# Altium project USTRZ.PrjPcb
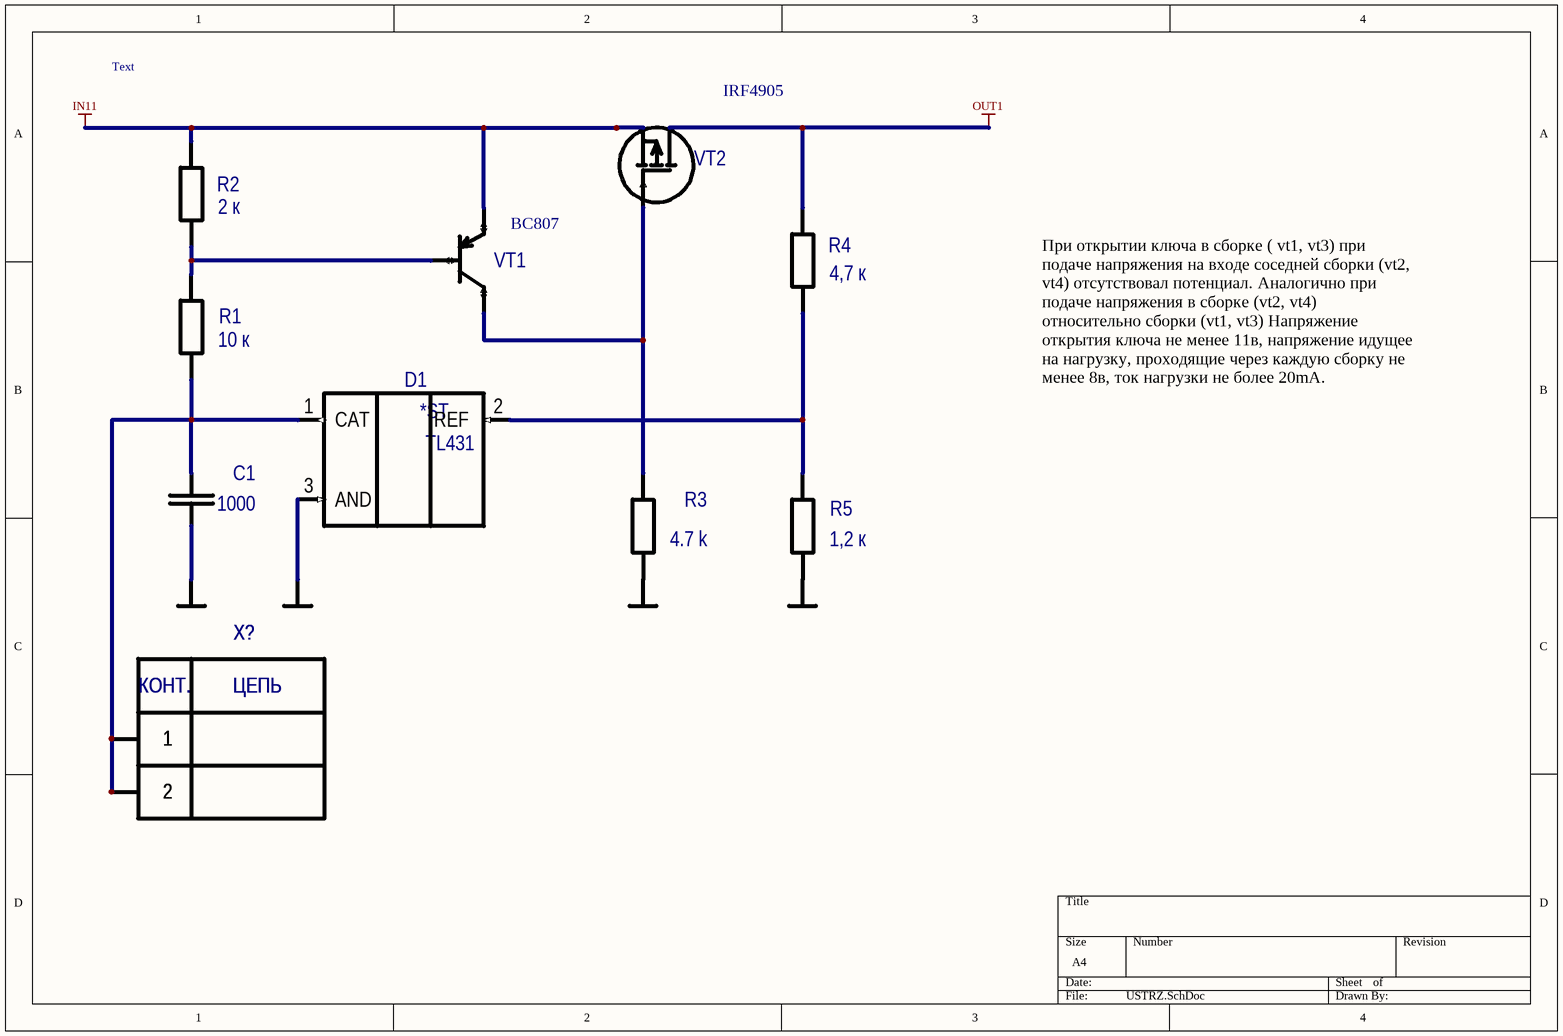
[diagram p0: USTRZ.SchDoc]
1 sheet, 13 parts. Net scope: global (net labels, ports and power ports of the same name join across sheets).
Board file: PCB1.PcbDoc

## Sheet USTRZ.SchDoc
size A4; SheetNumber: 1; SheetTotal: 1

### Parts
(Parts that share a designator on the sheet are numbered #1, #2 ... from top to bottom, then left to right.)
C1  1000  [CAPC1608L]
D1  TL431BIDBZR  [SOT23-3L]  (value not drawn)
R1  10 к  [RESC1608L]
R2  2 к  [RESC1608L]
R3  4.7 k  [RESC2012L]
R4  4,7 к  [RESC1608L]
R5  1,2 к  [RESC1608L]
VT1  (no value)  [SOT23-3L]
VT2  AUIRF5210S  [TO-263AB]  (value not drawn)
X?#1  2edg2  [2edg2]  (value not drawn)
X?#2  2edg2  [2edg2]  (value not drawn)
X?#3  2edg2  [2edg2]  (value not drawn)
X?#4  2edg2  [2edg2]  (value not drawn)

### Nets
GND: C1.1 D1.3(AND) R3.1 R5.1
IN11: R2.2 VT1.2(Emitter) VT2.3(source)
OUT1: R4.2 VT2.4(drain)
NetC1_2: C1.2 D1.1(CAT) R1.1 X?#1.1 X?#1.2 X?#2.1 X?#2.2 X?#3.1 X?#3.2 X?#4.1 X?#4.2
NetD1_2: D1.2(REF) R4.1 R5.2
NetR1_2: R1.2 R2.1 VT1.1(BASE)
NetR3_2: R3.2 VT1.3(Collector) VT2.1(gate)

### Notes on the sheet
- Text
- IRF4905
- (near VT1) BC807
- При открытии ключа в сборке ( vt1, vt3) при подаче напряжения на входе соседней сборки (vt2, vt4) отсутствовал потенциал. Аналогично при подаче напряжения в сборке (vt2, vt4) относительно сборки (vt1, vt3) Напряжение открытия ключа не менее 11в, напряжение идущее на нагрузку, проходящие через каждую сборку не менее 8в, ток нагрузки не более 20mA.
- (in symbol 2edg2) КОНТ.; ЦЕПЬ
- (in symbol TL431) *ST

### Library data of the parts
C1 = i6124B5A08701E000003: Чип-конденсатор; ManufacturerPartNumber: 0603 X7R 1000 пФ ±10 % 50 В; Name: 0603; Power/Voltage: 50 В; TKE/TKC: {TKE/TKC}; Tolerance: ±10 %; PCADSymbol: C; PCADLibrary: PASSIV.LIB; BCPId: *; Manufacturer: *; Type: Конденсатор; Value: 1000; ImKey: i6124B5A08701E000003; PCADType: C0603; PCADPattern: C0603
D1 = TL431: Микросхема; Manufacturer*: Texas Instruments; BCPId: *; Type: Микросхема; ManufacturerPartNumber: TL431BIDBZR; Package: SOT-23 (DBZ R-PDSO-G3)
R1 = i6124B5A087698000062: Чип-резистор; ManufacturerPartNumber: RC0603F*-**10KL Yageo; Name: 0603; Tolerance: ±1 %; PCADSymbol: R; PCADLibrary: PASSIV.LIB; BCPId: *; Manufacturer: *; Type: Резистор; Value: 10 к; ImKey: i6124B5A087698000062; PCADType: R0603; PCADPattern: R0603
R2 = i6124B5A087698000051: Чип-резистор; ManufacturerPartNumber: RC0603F*-**2KL Yageo; Name: 0603; Tolerance: ±1 %; PCADSymbol: R; PCADLibrary: PASSIV.LIB; BCPId: *; Manufacturer: *; Type: Резистор; Value: 2 к; ImKey: i6124B5A087698000051; PCADType: R0603; PCADPattern: R0603
R3 = R0805: Чип-резистор; Name: 0805; Tolerance: {Tolerance}; Value: {Value}; BCPId: *; Manufacturer: *; ManufacturerPartNumber: *; Type: Резистор
R4 = i6124B5A08769800005A: Чип-резистор; ManufacturerPartNumber: RC0603F*-**4K7L Yageo; Name: 0603; Tolerance: ±1 %; PCADSymbol: R; PCADLibrary: PASSIV.LIB; BCPId: *; Manufacturer: *; Type: Резистор; Value: 4,7 к; ImKey: i6124B5A08769800005A; PCADType: R0603; PCADPattern: R0603
R5 = i6124B5A08769800004C: Чип-резистор; ManufacturerPartNumber: RC0603F*-**1K2L Yageo; Name: 0603; Tolerance: ±1 %; PCADSymbol: R; PCADLibrary: PASSIV.LIB; BCPId: *; Manufacturer: *; Type: Резистор; Value: 1,2 к; ImKey: i6124B5A08769800004C; PCADType: R0603; PCADPattern: R0603
VT1 = MMBT3906: PNP general purpose transistors; Manufacturer: NXP; Type: Транзистор; SymAuthor: Семенов В.С.; BCPId: *; ManufacturerPartNumber: MMBT3906; Package: SOT23
VT2 = AUIRF5210S: P-Channel Power MOSFET; Manufacturer: Infineon; Type: Транзистор; SymAuthor: Пшеничный С.А.; BCPId: *; ManufacturerPartNumber: AUIRF5210S; Package: D2-Pak
X?#1-X?#4 = 2edg2: Угловой разъемный клеммник; SymAuthor: Юдин; BCPId: *; Manufacturer: *; ManufacturerPartNumber: 2edg2; Type: Вилка